# EAGLE design PCB_Instrumentação_v2 (EAGLE 8.2.0)
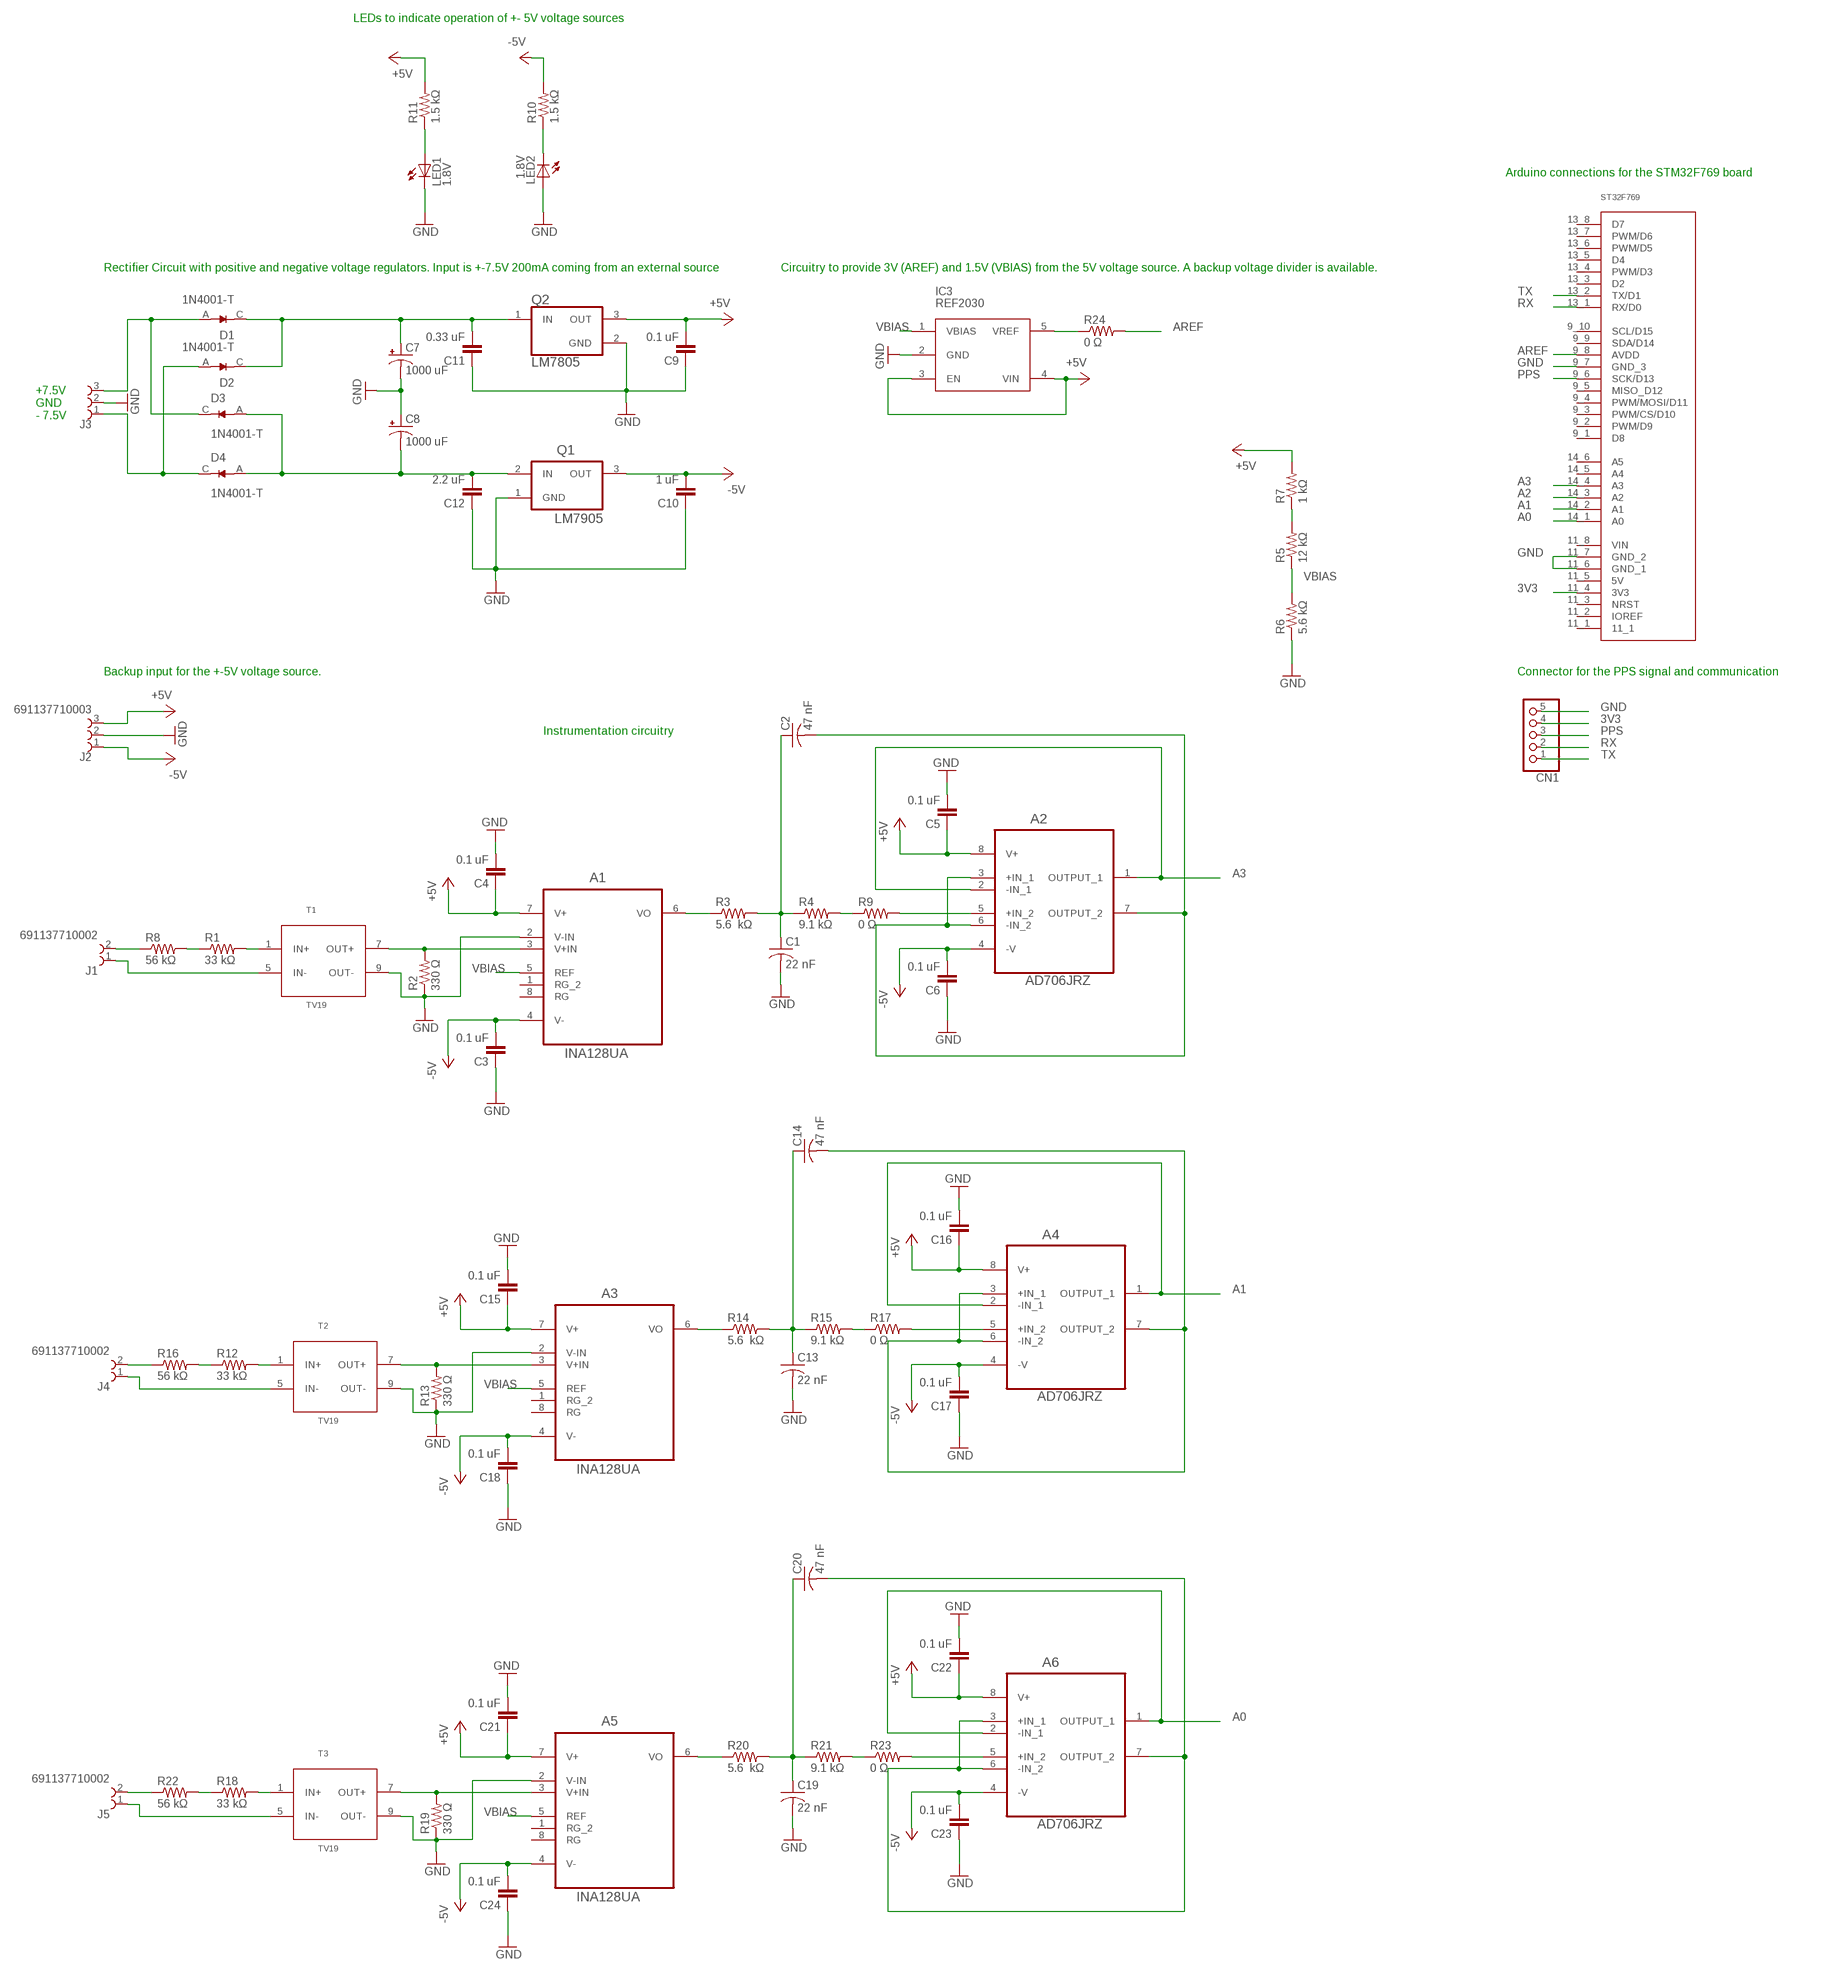
[diagram p0: schematic, sheet 1]

## Parts
A1  INA128UA  [SOIC127P600X175-8N]
A2  AD706JRZ  AD706JRZ-REEL-REEL7  [SOIC127P600X175-8N]
A3  INA128UA  [SOIC127P600X175-8N]
A4  AD706JRZ  AD706JRZ-REEL-REEL7  [SOIC127P600X175-8N]
A5  INA128UA  [SOIC127P600X175-8N]
A6  AD706JRZ  AD706JRZ-REEL-REEL7  [SOIC127P600X175-8N]
C1  22 nF  C-USC1206  [C1206]
C2  47 nF  C-USC1206  [C1206]
C3  0.1 uF  C-EUC0805  [C0805]
C4  0.1 uF  C-EUC0805  [C0805]
C5  0.1 uF  C-EUC0805  [C0805]
C6  0.1 uF  C-EUC0805  [C0805]
C7  1000 uF  CPOL-USE5-10.5  [E5-10,5]
C8  1000 uF  CPOL-USE5-10.5  [E5-10,5]
C9  0.1 uF  C-EUC0805  [C0805]
C10  1 uF  C-EUC0805  [C0805]
C11  0.33 uF  C-EUC0805  [C0805]
C12  2.2 uF  C-EUC0805  [C0805]
C13  22 nF  C-USC1206  [C1206]
C14  47 nF  C-USC1206  [C1206]
C15  0.1 uF  C-EUC0805  [C0805]
C16  0.1 uF  C-EUC0805  [C0805]
C17  0.1 uF  C-EUC0805  [C0805]
C18  0.1 uF  C-EUC0805  [C0805]
C19  22 nF  C-USC1206  [C1206]
C20  47 nF  C-USC1206  [C1206]
C21  0.1 uF  C-EUC0805  [C0805]
C22  0.1 uF  C-EUC0805  [C0805]
C23  0.1 uF  C-EUC0805  [C0805]
C24  0.1 uF  C-EUC0805  [C0805]
CN1  PINHD-1X5  [1X05]
D1  1N4001-T  [DIOAD953W69L521D272]
D2  1N4001-T  [DIOAD953W69L521D272]
D3  1N4001-T  [DIOAD953W69L521D272]
D4  1N4001-T  [DIOAD953W69L521D272]
IC3  REF2030  [TSOT-23_S5]
J1  691137710002  [691137710002]
J2  691137710003  [691137710003]
J3  691137710003  [691137710003]
J4  691137710002  [691137710002]
J5  691137710002  [691137710002]
LED1  1.8V  LED5MM  [LED5MM]
LED2  1.8V  LED5MM  [LED5MM]
Q1  LM7905  L7905ACV  [TO254P450X1020X1935-3P]
Q2  LM7805  LM7805CT/NOPB  [TO254P1054X470X2600-3]
R1  33 kΩ  R-US_0207/7  [0207/7]
R2  330 Ω  R-US_0207/7  [0207/7]
R3  5.6 kΩ  R-US_R1206  [R1206]
R4  9.1 kΩ  R-US_R1206  [R1206]
R5  12 kΩ  R-US_R1206  [R1206]
R6  5.6 kΩ  R-US_R1206  [R1206]
R7  1 kΩ  R-US_R1206  [R1206]
R8  56 kΩ  R-US_0207/7  [0207/7]
R9  0 Ω  R-US_R1206  [R1206]
R10  1.5 kΩ  R-US_R1206  [R1206]
R11  1.5 kΩ  R-US_R1206  [R1206]
R12  33 kΩ  R-US_0207/7  [0207/7]
R13  330 Ω  R-US_0207/7  [0207/7]
R14  5.6 kΩ  R-US_R1206  [R1206]
R15  9.1 kΩ  R-US_R1206  [R1206]
R16  56 kΩ  R-US_0207/7  [0207/7]
R17  0 Ω  R-US_R1206  [R1206]
R18  33 kΩ  R-US_0207/7  [0207/7]
R19  330 Ω  R-US_0207/7  [0207/7]
R20  5.6 kΩ  R-US_R1206  [R1206]
R21  9.1 kΩ  R-US_R1206  [R1206]
R22  56 kΩ  R-US_0207/7  [0207/7]
R23  0 Ω  R-US_R1206  [R1206]
R24  0 Ω  R-US_R1206  [R1206]
T1  TV19  [TV19]
T2  TV19  [TV19]
T3  TV19  [TV19]
U$1  ST32F769  [ST32F769]

## Nets
3V3: CN1.4 U$1.11_4(3V3)
+5V: A1.7(V+) A2.8(V+) A3.7(V+) A4.8(V+) A5.7(V+) A6.8(V+) C4.1 C5.1 C9.2 C15.1 C16.1 C21.1 C22.1 IC3.3(EN) IC3.4(VIN) J2.3 Q2.3(OUT) R7.2 R11.2
-5V: A1.4(V-) A2.4(-V) A3.4(V-) A4.4(-V) A5.4(V-) A6.4(-V) C3.2 C6.2 C10.2 C17.2 C18.2 C23.2 C24.2 J2.1 Q1.3(OUT) R10.2
A0: A6.1(OUTPUT_1) A6.2(-IN_1) U$1.14_1(A0)
A1: A4.1(OUTPUT_1) A4.2(-IN_1) U$1.14_2(A1)
A2: U$1.14_3(A2)
A3: A2.1(OUTPUT_1) A2.2(-IN_1) U$1.14_4(A3)
AREF: R24.2 U$1.9_8(AVDD)
GND: A1.2(V-IN) A3.2(V-IN) A5.2(V-IN) C1.2 C3.1 C4.2 C5.2 C6.1 C7.- C8.+ C9.1 C10.1 C11.1 C12.1 C13.2 C15.2 C16.2 C17.1 C18.1 C19.2 C21.2 C22.2 C23.1 C24.1 CN1.5 IC3.2(GND) J2.2 J3.2 LED1.K(C) LED2.A Q1.1(GND) Q2.2(GND) R2.1 R6.1 R13.1 R19.1 T1.9(OUT-) T2.9(OUT-) T3.9(OUT-) U$1.9_7(GND_3) U$1.11_6(GND_1) U$1.11_7(GND_2)
N$1: R1.2 T1.1(IN+)
N$2: A1.3(V+IN) R2.2 T1.7(OUT+)
N$3: A1.6(VO) R3.1
N$4: C1.1 C2.1 R3.2 R4.1
N$5: R4.2 R9.1
N$6: A2.3(+IN_1) A2.6(-IN_2) A2.7(OUTPUT_2) C2.2
N$7: R5.2 R7.1
N$8: J1.2 R8.1
N$9: J1.1 T1.5(IN-)
N$10: R1.1 R8.2
N$11: C7.+ C11.2 D1.C D2.C Q2.1(IN)
N$12: C8.- C12.2 D3.A D4.A Q1.2(IN)
N$13: D2.A D4.C J3.1
N$14: D1.A D3.C J3.3
N$15: A2.5(+IN_2) R9.2
N$16: LED1.A R11.1
N$17: LED2.K(C) R10.1
N$18: R12.2 T2.1(IN+)
N$19: A3.3(V+IN) R13.2 T2.7(OUT+)
N$20: A3.6(VO) R14.1
N$21: C13.1 C14.1 R14.2 R15.1
N$22: A4.3(+IN_1) A4.6(-IN_2) A4.7(OUTPUT_2) C14.2
N$23: J4.1 T2.5(IN-)
N$24: J4.2 R16.1
N$25: R12.1 R16.2
N$26: R15.2 R17.1
N$27: A4.5(+IN_2) R17.2
N$28: R18.2 T3.1(IN+)
N$29: A5.3(V+IN) R19.2 T3.7(OUT+)
N$30: A5.6(VO) R20.1
N$31: C19.1 C20.1 R20.2 R21.1
N$32: A6.3(+IN_1) A6.6(-IN_2) A6.7(OUTPUT_2) C20.2
N$33: J5.1 T3.5(IN-)
N$34: J5.2 R22.1
N$35: R18.1 R22.2
N$36: R21.2 R23.1
N$37: A6.5(+IN_2) R23.2
N$39: IC3.5(VREF) R24.1
PPS: CN1.3 U$1.9_6(SCK/D13)
RX: CN1.2 U$1.13_1(RX/D0)
TX: CN1.1 U$1.13_2(TX/D1)
VBIAS: A1.5(REF) A3.5(REF) A5.5(REF) IC3.1(VBIAS) R5.1 R6.2
Unconnected: A1.1(RG_2) A1.8(RG) A3.1(RG_2) A3.8(RG) A5.1(RG_2) A5.8(RG) U$1.9_1(D8) U$1.9_2(PWM/D9) U$1.9_3(PWM/CS/D10) U$1.9_4(PWM/MOSI/D11) U$1.9_5(MISO_D12) U$1.9_9(SDA/D14) U$1.9_10(SCL/D15) U$1.11_1 U$1.11_2(IOREF) U$1.11_3(NRST) U$1.11_5(5V) U$1.11_8(VIN) U$1.13_3(D2) U$1.13_4(PWM/D3) U$1.13_5(D4) U$1.13_6(PWM/D5) U$1.13_7(PWM/D6) U$1.13_8(D7) U$1.14_5(A4) U$1.14_6(A5)

## Notes on the sheet
- LEDs to indicate operation of +- 5V voltage sources
- Arduino connections for the STM32F769 board
- Rectifier Circuit with positive and negative voltage regulators. Input is +-7.5V 200mA coming from an external source | Circuitry to provide 3V (AREF) and 1.5V (VBIAS) from the 5V voltage source. A backup voltage divider is available.
- +7.5V
  GND
  - 7.5V
- Backup input for the +-5V voltage source. | Connector for the PPS signal and communication
- Instrumentation circuitry

## Library data of the parts
A1 A3 A5 = INA128UA:INA128UA: INSTRUMENTATION AMPLIFIER; AVAILABILITY: Unavailable; MF: Texas; MP: INA128UA; PACKAGE: SOIC-8 Burr Brown; PRICE: None
A2 A4 A6 = AD706JRZ_v2:AD706JRZ-REEL-REEL7: Picoampere Input Current Dual Bipolar Op Amp; AVAILABILITY: Unavailable; DESCRIPTION: Ic Opamp Gp Dual Prec 15ma 8soic - Ad706jrz-Reel7; MF: Analog Devices; MP: AD706JRZ-REEL7; PACKAGE: SOIC-8 Analog Devices; PRICE: None
C1 C2 C13 C14 C19 C20 = rcl:C-US: CAPACITOR, American symbol
C3-C6 C9-C12 C15-C18 C21-C24 = resistor:C-EU: CAPACITOR, European symbol
C7 C8 = rcl:CPOL-US: POLARIZED CAPACITOR, American symbol
CN1 = my_pinhead:PINHD-1X5: PIN HEADER
D1-D4 = 1N4001-T:1N4001-T: Diode, Standard Recovery, 1a, 50v, Do-204al-2, Full Reel; AVAILABILITY: Unavailable; DESCRIPTION: Diode, Standard, 1A, 50V; MF: ON Semiconductor; MP: 1N4001; PACKAGE: DO-41 ON Semiconductor; PRICE: None
IC3 = TSOT-23_S5:REF2030: REF2030 Low-Drift, Low-Power, Dual-Output, VREF and VREF / 2 Voltage References
J1 J4 J5 = Term Block 2pos Side Entry 5mm:691137710002: SERIE 1377 - 5.00 MM - HORIZONTAL CABLE ENTRY WITH PRESSURE CLAMP - GLOW WIRE PLASTIC - WR-TBL <http://katalog.we-online.de/media/images/v2/Family_WR-TBL1_6911377100xx.jpg> Details see: http://katalog.we-online.de/en/em/TBL_5_00_1377_HORIZONTAL_ENTRY_W_PRESSURE_CLAMP_GLOW_WIRE_6911377100xx Created by Yingchun,Shan 2016(C) Wurth Elektronik; AVAILABILITY: Unavailable; DESCRIPTION: Term Block 2pos Side Entry 5mm; MF: Wurth Electronics; MP: 691137710002; PACKAGE: None; PRICE: None
J2 J3 = Term Block 3pos 5mm:691137710003: SERIE 1377 - 5.00 MM - HORIZONTAL CABLE ENTRY WITH PRESSURE CLAMP - GLOW WIRE PLASTIC - WR-TBL <http://katalog.we-online.de/media/images/v2/Family_WR-TBL1_6911377100xx.jpg> Details see: http://katalog.we-online.de/en/em/TBL_5_00_1377_HORIZONTAL_ENTRY_W_PRESSURE_CLAMP_GLOW_WIRE_6911377100xx Created by Yingchun,Shan 2016(C) Wurth Elektronik; AVAILABILITY: Unavailable; DESCRIPTION: Term Block 3POS Side Entry 5MM; MF: Wurth Electronics; MP: 691137710003; PACKAGE: None; PRICE: None
LED1 = my_led:LED: LED OSRAM: - CHIPLED LG R971, LG N971, LY N971, LG Q971, LY Q971, LO R971, LY R971 LH N974, LH R974 LS Q976, LO Q976, LY Q976 LO Q996 - Hyper CHIPLED LW Q18S LB Q993, LB Q99A, LB R99A - SideLED LS A670, LO A670, LY A670, LG A670, LP A670 LB A673, LV A673, LT A673, LW A673 LH A674 LY A675 LS A676, LA A676, LO A676, LY A676, LW A676 LS A679, LY A679, LG A679 - Hyper Micro SIDELED® LS Y876, LA Y876, LO Y876, LY Y876 LT Y87S - SmartLED LW L88C, LW L88S LB L89C, LB L89S, LG L890 LS L89K, LO L89K, LY L89K LS L896, LA L896, LO L896, LY L896 - TOPLED LS T670, LO T670, LY T670, LG T670, LP T670 LSG T670, LSP T670, LSY T670, LOP T670, LYG T670 LG T671, LOG T671, LSG T671 LB T673, LV T673, LT T673, LW T673 LH T674 LS T676, LA T676, LO T676, LY T676, LB T676, LH T676, LSB T676, LW T676 LB T67C, LV T67C, LT T67C, LS T67K, LO T67K, LY T67K, LW E67C LS E67B, LA E67B, LO E67B, LY E67B, LB E67C, LV E67C, LT E67C LW T67C LS T679, LY T679, LG T679 LS T770, LO T770, LY T770, LG T770, LP T770 LB T773, LV T773, LT T773, LW T773 LH T774 LS E675, LA E675, LY E675, LS T675 LS T776, LA T776, LO T776, LY T776, LB T776 LHGB T686 LT T68C, LB T68C - Hyper Mini TOPLED® LB M676 - Mini TOPLED Santana® LG M470 LS M47K, LO M47K, LY M47K Source: http://www.osram.convergy.de LUXEON: - LUMILED® LXK2-PW12-R00, LXK2-PW12-S00, LXK2-PW14-U00, LXK2-PW14-V00 LXK2-PM12-R00, LXK2-PM12-S00, LXK2-PM14-U00 LXK2-PE12-Q00, LXK2-PE12-R00, LXK2-PE12-S00, LXK2-PE14-T00, LXK2-PE14-U00 LXK2-PB12-K00, LXK2-PB12-L00, LXK2-PB12-M00, LXK2-PB14-N00, LXK2-PB14-P00, LXK2-PB14-Q00 LXK2-PR12-L00, LXK2-PR12-M00, LXK2-PR14-Q00, LXK2-PR14-R00 LXK2-PD12-Q00, LXK2-PD12-R00, LXK2-PD12-S00 LXK2-PH12-R00, LXK2-PH12-S00 LXK2-PL12-P00, LXK2-PL12-Q00, LXK2-PL12-R00 Source: www.luxeon.com KINGBRIGHT: KA-3528ASYC Source: www.kingbright.com
LED2 = led:LED: LED OSRAM: - CHIPLED LG R971, LG N971, LY N971, LG Q971, LY Q971, LO R971, LY R971 LH N974, LH R974 LS Q976, LO Q976, LY Q976 LO Q996 - Hyper CHIPLED LW Q18S LB Q993, LB Q99A, LB R99A - SideLED LS A670, LO A670, LY A670, LG A670, LP A670 LB A673, LV A673, LT A673, LW A673 LH A674 LY A675 LS A676, LA A676, LO A676, LY A676, LW A676 LS A679, LY A679, LG A679 - Hyper Micro SIDELED® LS Y876, LA Y876, LO Y876, LY Y876 LT Y87S - SmartLED LW L88C, LW L88S LB L89C, LB L89S, LG L890 LS L89K, LO L89K, LY L89K LS L896, LA L896, LO L896, LY L896 - TOPLED LS T670, LO T670, LY T670, LG T670, LP T670 LSG T670, LSP T670, LSY T670, LOP T670, LYG T670 LG T671, LOG T671, LSG T671 LB T673, LV T673, LT T673, LW T673 LH T674 LS T676, LA T676, LO T676, LY T676, LB T676, LH T676, LSB T676, LW T676 LB T67C, LV T67C, LT T67C, LS T67K, LO T67K, LY T67K, LW E67C LS E67B, LA E67B, LO E67B, LY E67B, LB E67C, LV E67C, LT E67C LW T67C LS T679, LY T679, LG T679 LS T770, LO T770, LY T770, LG T770, LP T770 LB T773, LV T773, LT T773, LW T773 LH T774 LS E675, LA E675, LY E675, LS T675 LS T776, LA T776, LO T776, LY T776, LB T776 LHGB T686 LT T68C, LB T68C - Hyper Mini TOPLED® LB M676 - Mini TOPLED Santana® LG M470 LS M47K, LO M47K, LY M47K Source: http://www.osram.convergy.de LUXEON: - LUMILED® LXK2-PW12-R00, LXK2-PW12-S00, LXK2-PW14-U00, LXK2-PW14-V00 LXK2-PM12-R00, LXK2-PM12-S00, LXK2-PM14-U00 LXK2-PE12-Q00, LXK2-PE12-R00, LXK2-PE12-S00, LXK2-PE14-T00, LXK2-PE14-U00 LXK2-PB12-K00, LXK2-PB12-L00, LXK2-PB12-M00, LXK2-PB14-N00, LXK2-PB14-P00, LXK2-PB14-Q00 LXK2-PR12-L00, LXK2-PR12-M00, LXK2-PR14-Q00, LXK2-PR14-R00 LXK2-PD12-Q00, LXK2-PD12-R00, LXK2-PD12-S00 LXK2-PH12-R00, LXK2-PH12-S00 LXK2-PL12-P00, LXK2-PL12-Q00, LXK2-PL12-R00 Source: www.luxeon.com KINGBRIGHT: KA-3528ASYC Source: www.kingbright.com
Q1 = L7905ACV:L7905ACV: 2 % negative voltage regulators; AVAILABILITY: Unavailable; DESCRIPTION: L7905 Series -5 V 1.5 A Negative Voltage Regulator Flange Mount - TO-220; MF: STMicroelectronics; MP: L7905ACV; PACKAGE: TO-220 STMicroelectronics; PRICE: None
Q2 = LM7805CT_NOPB:LM7805CT/NOPB: Standard Regulator Pos 5V 1A 3-Pin(3+Tab) TO-220 Rail; AVAILABILITY: Unavailable; MF: ON Semiconductor; MP: LM7805CT; PACKAGE: TO-220 ON Semiconductor; PRICE: None
R1 R2 R8 R12 R13 R16 R18 R19 R22 = my_resistor:R-US_: RESISTOR, American symbol
R3-R7 R9-R11 R14 R15 R17 R20 R21 R23 R24 = resistor:R-US_: RESISTOR, American symbol
T1-T3 = TV19:TV19: Model: TV19 Characteristics: TV19 is a current type voltage transformer, using ultracrystalline core. Primarey current will be different according to different voltage working on the current-limiting resistance. And there will be a same current at secondary as primary. Technical index: Mounting type: PCB mounting Material of the core: Nanocrystalline Flame resistance: UL94-V0 Operating temperature: -35ºC~+85ºC Storage temperature: -45ºC~+95ºC Frequency range: 20Hz - 20KHz Dielectric strength: 3.5KV 50Hz 1min Electrical parameters : Primary Max. working current: 5mA Secondary output current: 5mA Turns ratio: 1000:1000 Accuracy: +-1% Linearity: 0.2% Max. measuring voltage: 500V Phase difference: <=25º Max. sampling resistance: 500 ohms Weight: 15g
U$1 = ST32F769:ST32F769: 32F769IDISCOVERY board

## Board
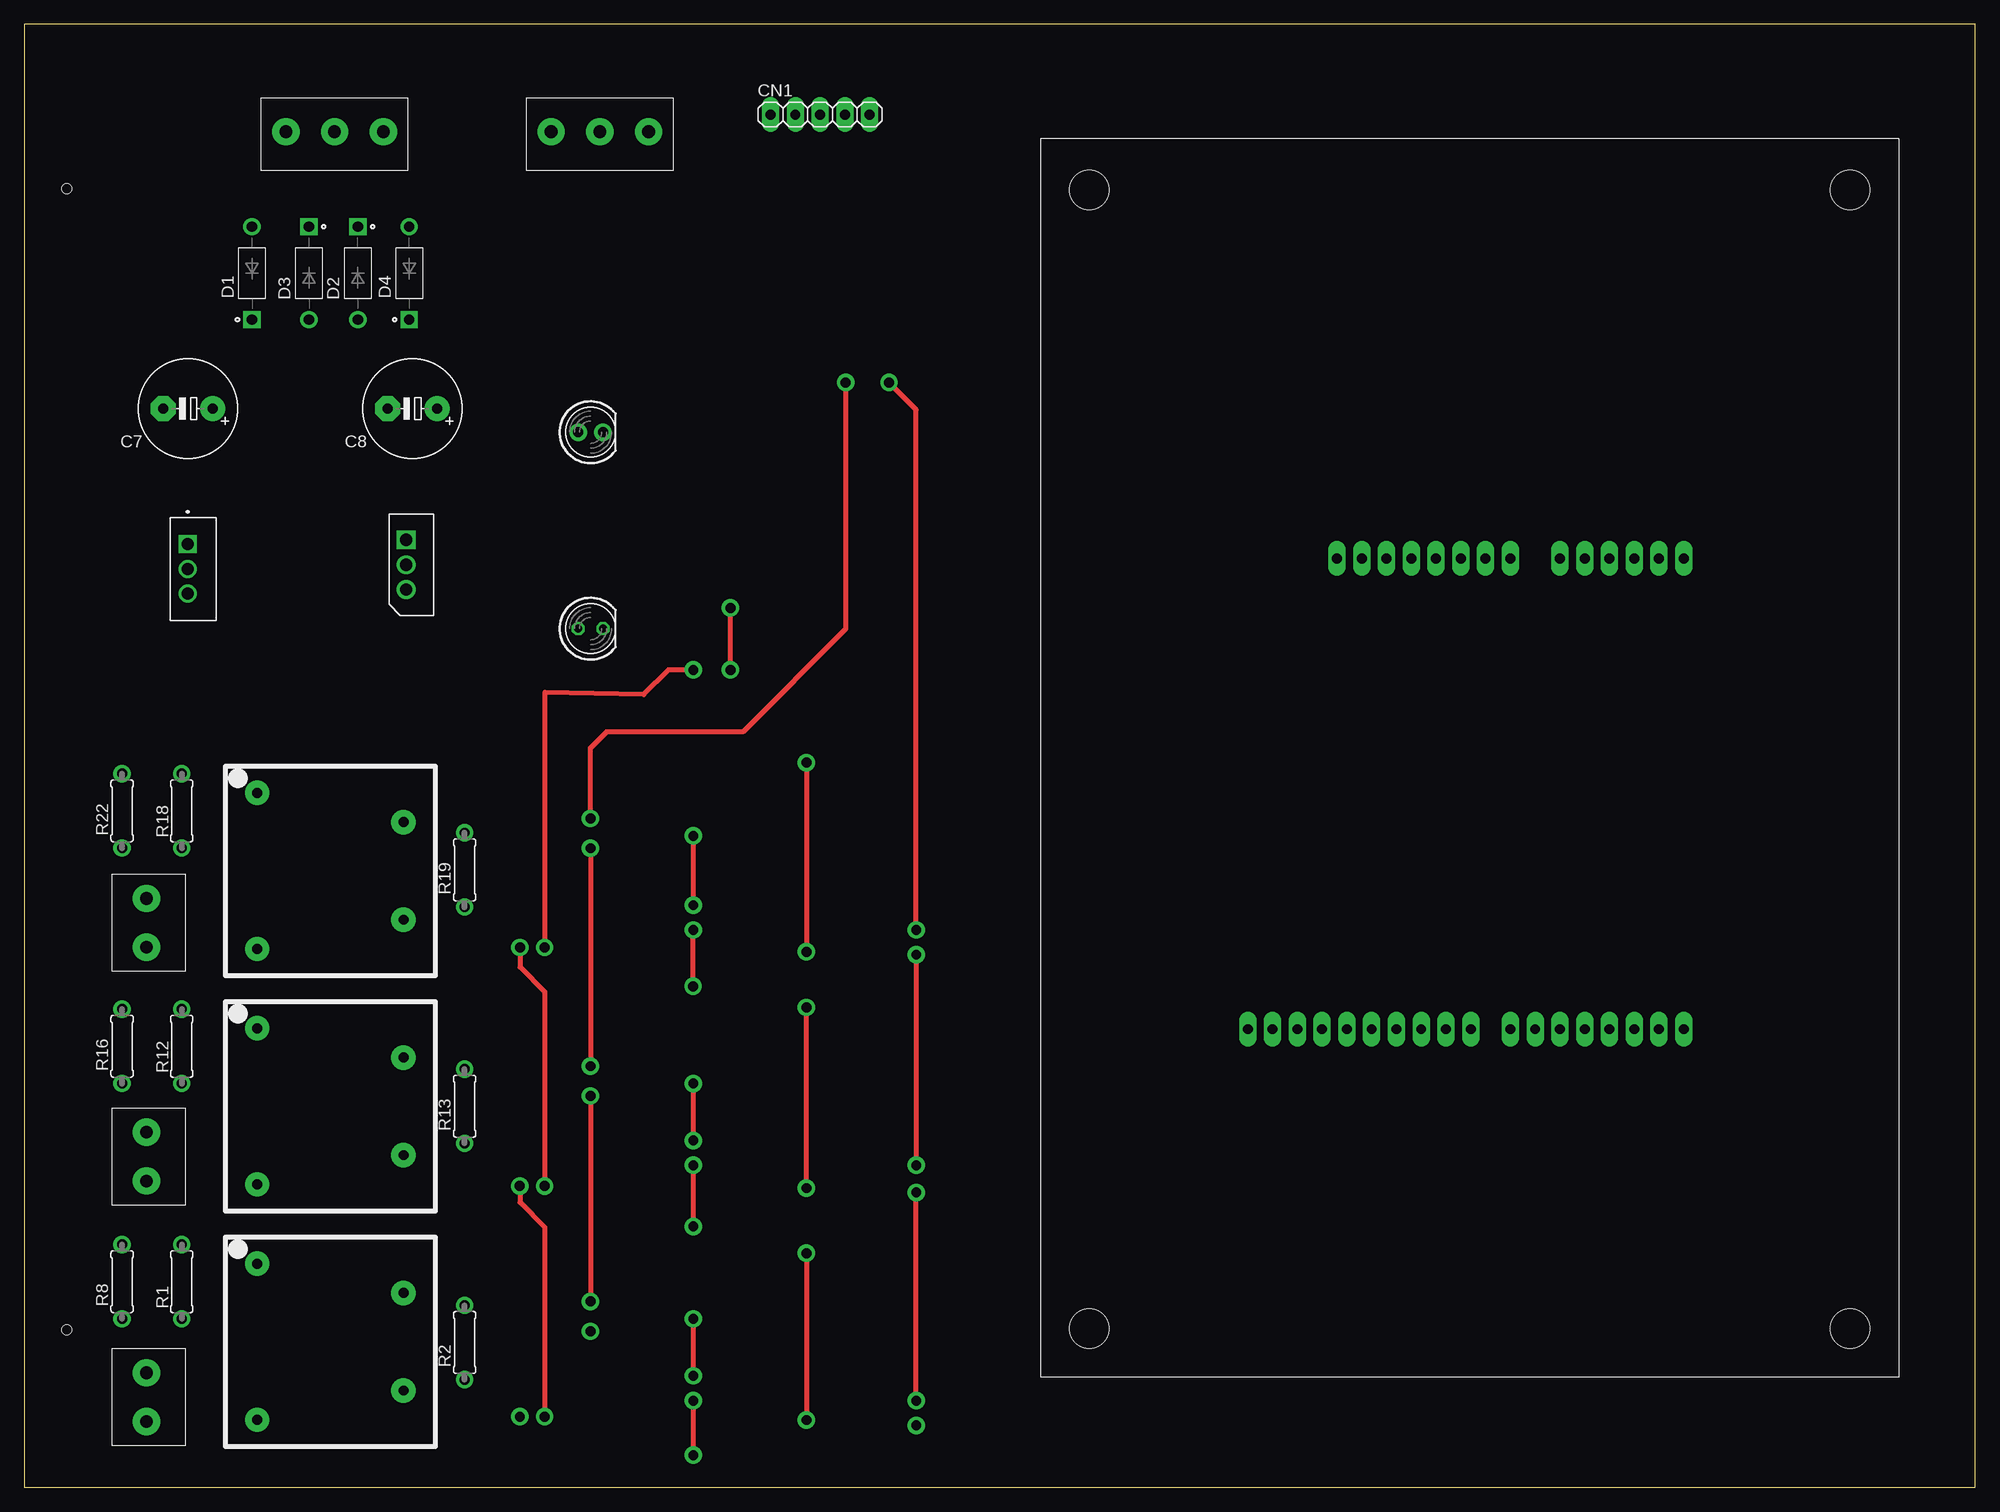
[diagram p1: board, top side]
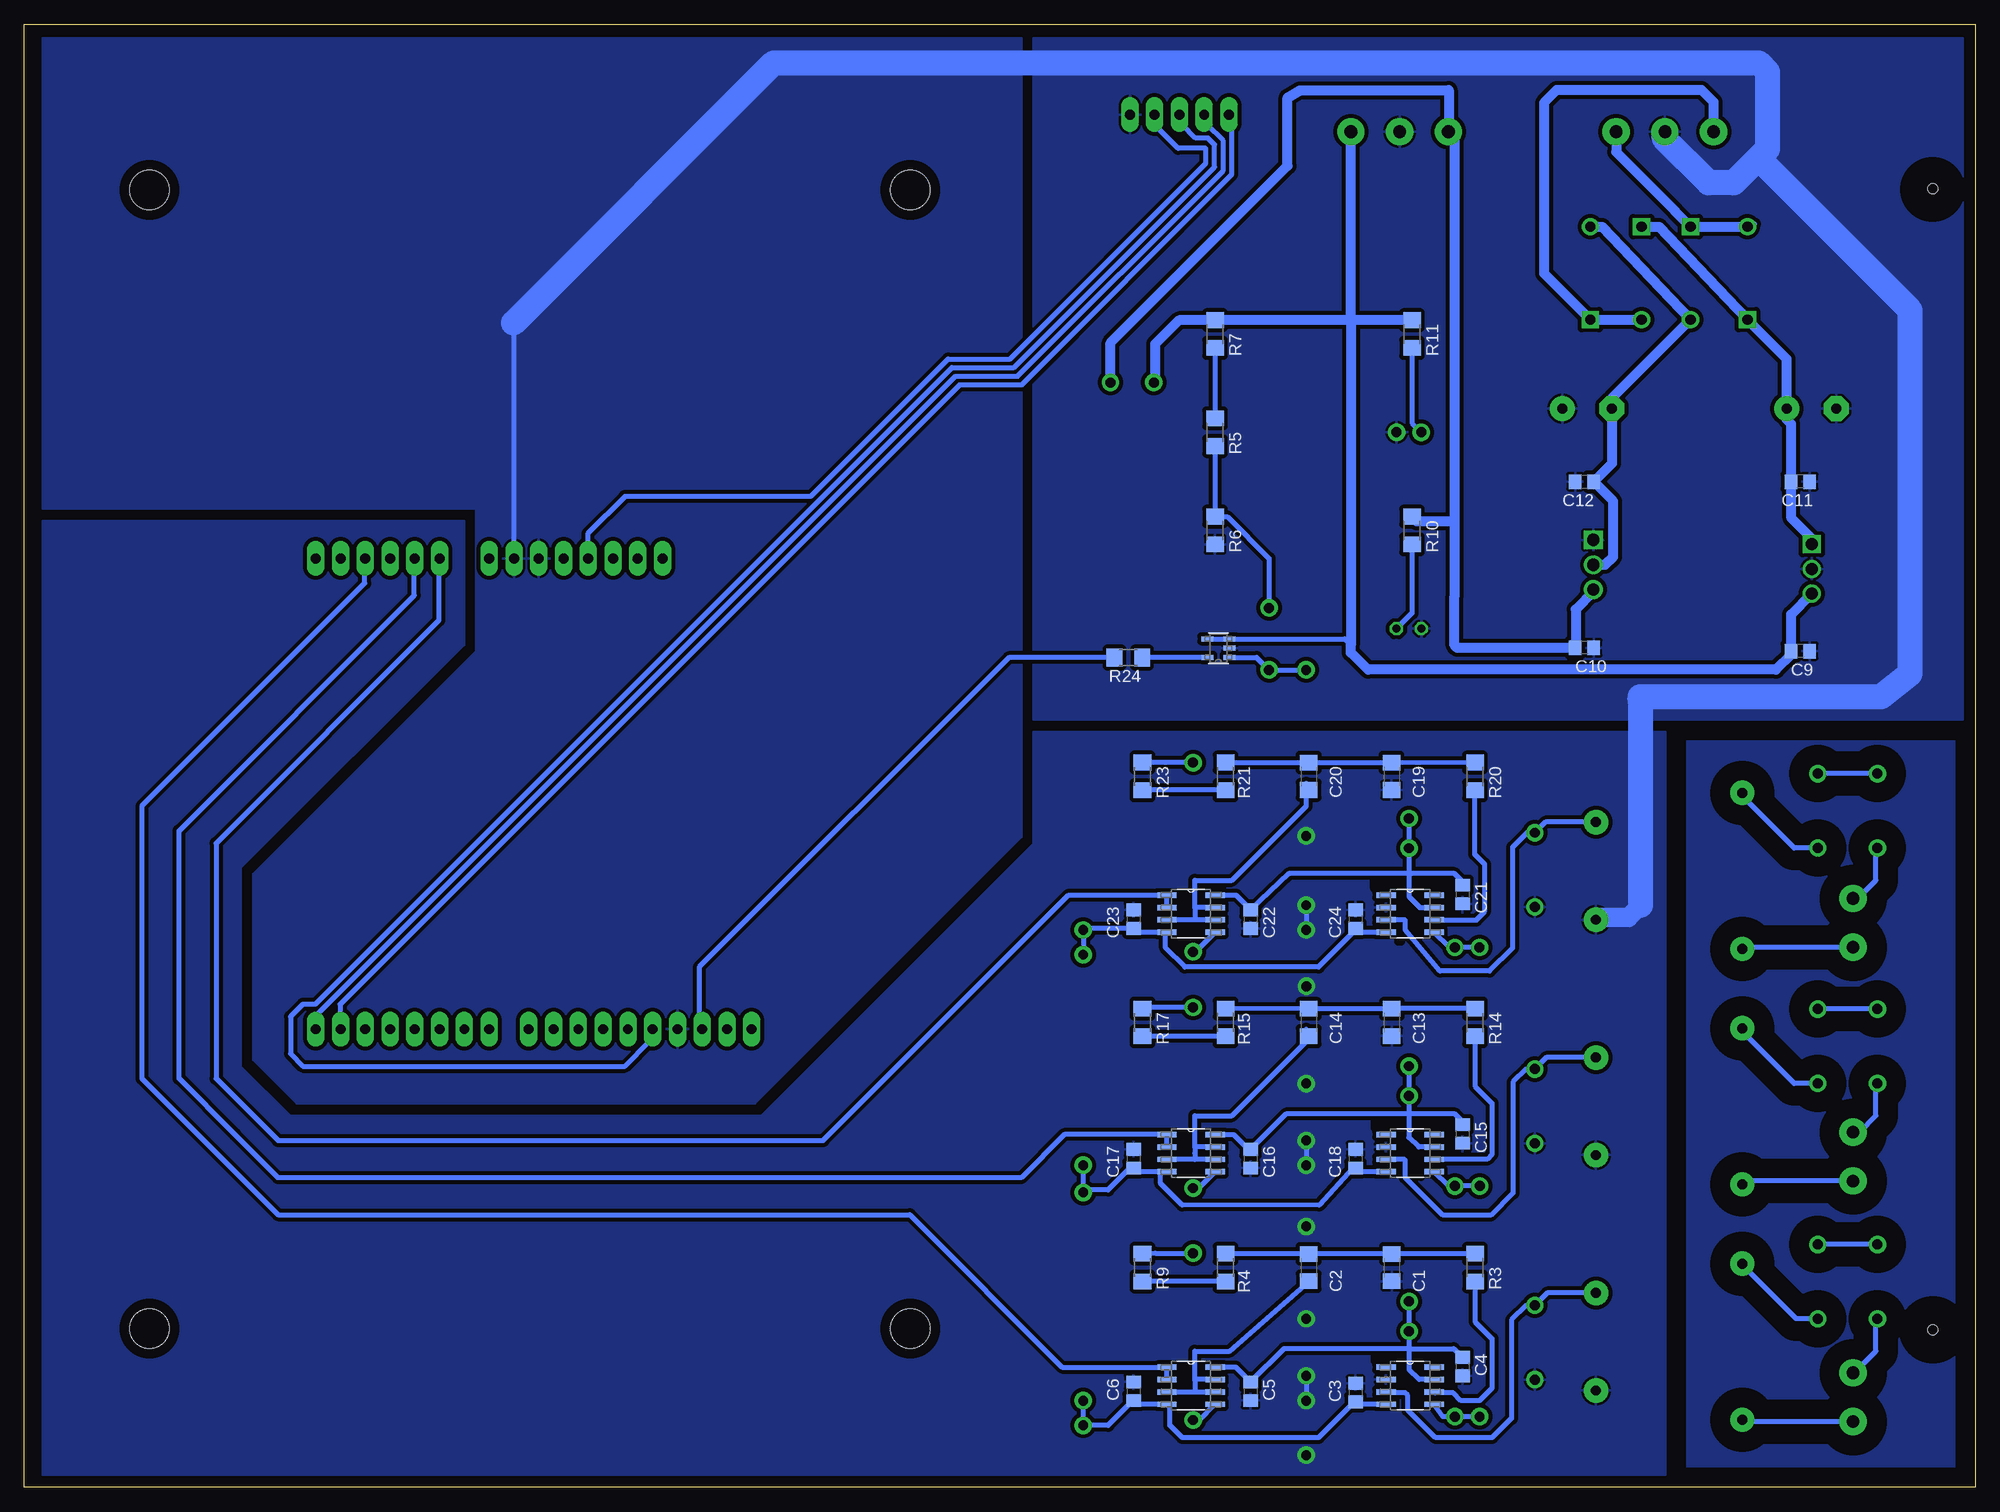
[diagram p2: board, bottom side, seen from below]

Size 200 x 150 mm. Coordinates in mm from the lower left corner, seen from the top.
Outline: 0,0 200,0 200,150 0,150 0,0
Copper layers (1*16): Top 0.035mm / dielectric 1.5mm / Bottom 0.035mm
Design rules "default *": minimum track width 6mil, minimum drill 0.35mm, track to track 15mil, track to pad 15mil, pad to pad 15mil, via to via 15mil, smd to smd 15mil, copper to edge 40mil, drill to drill 15mil, minimum pad ring 10mil, minimum via ring 8mil, stop-mask expansion 4mil, vias tented up to drill 0mil, thermal gap 10mil
Holes 1 mm at 4.34,16.15 4.34,133.16
bRestrict: area 54.6,12.9 to 57.6,13.7; area 59.1,12.9 to 61.5,13.7; area 53.5,36.8 to 56.3,37.7; area 53.3,34.2 to 54.3,36.9; area 59.1,36.8 to 61.5,37.8; area 53.6,61.4 to 56.4,62.4; area 53.4,58.6 to 54.3,62.4; area 59.6,61.4 to 61.6,62.4; area 84,9 to 85.3,11.8; area 2.7,131.4 to 6,134.7; area 4.2,16 to 4.5,16.3; area 53.5,10.3 to 54.3,13.6; 14 more areas

### Footprints (pad centres in the part's own frame; a part is rotated, then mirrored left to right if it is on the bottom)
SOIC127P600X175-8N = smd 1.981 x 0.559: 1 -2.464,1.905; 2 -2.464,0.635; 3 -2.464,-0.635; 4 -2.464,-1.905; 5 2.464,-1.905; 6 2.464,-0.635; 7 2.464,0.635; 8 2.464,1.905
C1206 = smd 1.6 x 1.8: 1 -1.4,0; 2 1.4,0
C0805 = smd 1.3 x 1.5: 1 -0.95,0; 2 0.95,0
E5-10,5 = drill 1.016 pad 2.54: + -2.54,0 | drill 1.016 pad 2.54 octagon: - 2.54,0
1X05 = drill 1.016 pad 1.778 long: 1 -5.08,0; 2 -2.54,0; 3 0,0; 4 2.54,0; 5 5.08,0
DIOAD953W69L521D272 = drill 1.06 pad 1.778: A 4.765,0 | drill 1.06 pad 1.778 square: C -4.765,0
TSOT-23_S5 = smd 1.219 x 0.508: 1 -1.143,0.95; 2 -1.143,0; 3 -1.143,-0.95; 4 1.143,-0.95; 5 1.143,0.95
691137710002 = drill 1.3 pad 2.794: 1 -2.5,0; 2 2.5,0
691137710003 = drill 1.3 pad 2.794: 1 -5,0; 2 0,0; 3 5,0
LED5MM = drill 1.016 pad 1.778: A -1.27,0; K 1.27,0
LED5MM' = drill 0.813 octagon: A -1.27,0; K 1.27,0
TO254P450X1020X1935-3P = drill 1.27 square: 1 -5.08,-1.092 | drill 1.27: 2 -2.54,-1.092; 3 0,-1.092
TO254P1054X470X2600-3 = drill 1.24 square: 1 0,0 | drill 1.24: 2 2.54,0; 3 5.08,0
0207/7 = drill 1.016 pad 1.778: 1 -3.81,0; 2 3.81,0
R1206 = smd 1.6 x 1.803: 1 -1.422,0; 2 1.422,0
TV19 = drill 1.016 pad 2.5: 1 -8,-7.5; 5 8,-7.5; 7 -5,7.5; 9 5,7.5
ST32F769 = drill 1.016 pad 1.778 long: 9_1 43.884,91.29; 9_2 46.424,91.29; 9_3 48.964,91.29; 9_4 51.504,91.29; 9_5 54.044,91.29; 9_6 56.584,91.29; 9_7 59.124,91.29; 9_8 61.664,91.29; 9_9 64.204,91.29; 9_10 66.744,91.29; 11_1 57.6,43.03; 11_2 55.06,43.03; 11_3 52.52,43.03; 11_4 49.98,43.03; 11_5 47.44,43.03; 11_6 44.9,43.03; 11_7 42.36,43.03; 11_8 39.82,43.03; 13_1 22.04,91.29; 13_2 24.58,91.29; 13_3 27.12,91.29; 13_4 29.66,91.29; 13_5 32.2,91.29; 13_6 34.74,91.29; 13_7 37.28,91.29; 13_8 39.82,91.29; 14_1 34.74,43.03; 14_2 32.2,43.03; 14_3 29.66,43.03; 14_4 27.12,43.03; 14_5 24.58,43.03; 14_6 22.04,43.03 | hole 4.064: 5,5.26; 83,5.26; 83,122; 5,122

### Placement (x,y rotation side)
A1  57.93,10.42 0 bottom
A2  80.39,10.42 0 bottom
A3  57.93,34.26 0 bottom
A4  80.39,34.26 0 bottom
A5  57.93,58.82 0 bottom
A6  80.39,58.82 0 bottom
C1  59.8,22.53 270 bottom
C2  68.33,22.53 270 bottom
C3  63.52,9.72 270 bottom
C4  52.55,12.39 270 bottom
C5  74.28,9.85 270 bottom
C6  86.28,9.85 270 bottom
C7  16.77,110.6 180 top
C8  39.77,110.6 180 top
C9  17.92,85.73 180 bottom
C10  40.06,86.08 180 bottom
C11  17.92,103.11 180 bottom
C12  40.06,103.11 0 bottom
C13  59.8,47.66 270 bottom
C14  68.33,47.66 270 bottom
C15  52.55,36.23 270 bottom
C16  74.28,33.69 270 bottom
C17  86.28,33.69 270 bottom
C18  63.52,33.69 270 bottom
C19  59.83,72.9 270 bottom
C20  68.33,72.9 270 bottom
C21  52.55,60.79 270 bottom
C22  74.28,58.25 270 bottom
C23  86.28,58.25 270 bottom
C24  63.52,58.25 270 bottom
CN1  81.58,140.76 0 top
D1  23.35,124.49 90 top
D2  34.19,124.49 270 top
D3  29.19,124.49 270 top
D4  39.46,124.49 90 top
IC3  77.58,86.04 180 bottom
J1  12.51,9.24 90 top
J2  59,139 0 top
J3  691137710003  [691137710003]  31.8,139 0 top
J4  12.51,33.91 90 top
J5  12.51,57.87 90 top
LED1  58.05,108.18 0 top
LED2  1.8V  [LED5MM']  58.05,88.04 0 top
Q1  40.23,92.05 270 top
Q2  16.74,96.71 270 top
R1  16.13,21.09 270 top
R2  45.14,14.85 90 top
R3  51.28,22.53 90 bottom
R4  76.85,22.53 270 bottom
R5  77.93,108.18 90 bottom
R6  77.93,98.11 90 bottom
R7  77.93,118.25 90 bottom
R8  10.02,21.09 90 top
R9  85.37,22.53 90 bottom
R10  57.73,98.11 90 bottom
R11  57.73,118.25 90 bottom
R12  16.13,45.22 270 top
R13  45.14,39.08 90 top
R14  51.28,47.66 90 bottom
R15  76.85,47.66 270 bottom
R16  10.02,45.22 90 top
R17  85.37,47.66 90 bottom
R18  16.13,69.36 270 top
R19  45.14,63.31 90 top
R20  51.28,72.9 90 bottom
R21  76.85,72.9 270 bottom
R22  10.02,69.36 90 top
R23  85.37,72.9 90 bottom
R24  86.82,85.08 180 bottom
T1  31.37,14.93 270 top
T2  31.37,39.06 270 top
T3  31.37,63.2 270 top
U$1  192.17,138.27 180 top

### Tracks (layer width: path | path; a pad name or v marks a point on that pad's centre or on a via)
3V3
  Bottom 0.508: U$1.11_4 142.24,95.29 142.24,97.79 138.43,101.6 119.38,101.6 105.28,115.7 98.93,115.7 78.87,135.76 78.87,137.3 81.72,137.3 84.12,139.7 CN1.4
+5V  (via drill 1.02 pad 1.78)
  Top 0.5: 58.04,75.82 59.69,77.47 73.66,77.47 84.2,88.01 v84.2,113.28
  Top 0.508: v58.04,68.58 58.04,75.82 | v58.04,65.53 v58.04,43.18 | v58.04,40.13 v58.04,19.05
  Bottom 0.5: 18.88,85.75 C9.2 | 63.71,119.67 64,119.38 64.29,119.67 | IC3.4 IC3.3 64.63,86.99 64,86.36 | C4.1 53.44,14.22 58.04,14.22 | 75.8,12.32 C5.1 70.86,14.22 58.04,14.22 | A1.7 57.03,11.05 58.04,12.06 58.04,14.22 | 84.07,113.41 v84.2,113.28 | v58.04,16 58.04,14.22 | 58.04,38.24 58.04,35.88 | v58.04,40.13 58.04,38.24 | 58.04,35.88 58.05,35.87 | A3.7 57.05,34.9 58.04,35.88 | C15.1 52.55,37.5 53.33,38.28 58,38.28 | 58,38.28 58.04,38.24 | 58,38.28 70.65,38.28 C16.1 74.48,34.64 76,36.16 A4.8 | A5.7 56.93,59.45 58.04,60.56 58.05,62.93 | v58.04,65.53 58.05,62.93 | C21.1 52.55,62.1 53.37,62.92 57.81,62.92 58.05,62.93 | 58.05,62.93 70.34,62.93 C22.1 74.28,59.24 75.74,60.7 77.9,60.7 A6.8
  Bottom 0.508: v58.04,68.58 v58.04,65.53 | v58.04,43.18 v58.04,40.13 | v58.04,19.05 v58.04,16 | 75.8,12.32 A2.8
  Bottom 1.016: J2.3 64,119.38 64,86.36 64,85.59 62.24,83.83 20.43,83.83 18.87,85.39 C9.2 | R11.2 63.71,119.67 | 64.29,119.67 R7.2 81.62,119.67 84.07,117.22 84.07,113.41 | C9.2 18.87,85.56 | C9.2 18.87,89.5 Q2.3
-5V  (via drill 1.02 pad 1.78)
  Top 0.5: v91.44,57.15 91.44,110.49 v88.65,113.28
  Top 0.508: v91.44,8.89 v91.44,30.23 | v91.44,54.61 v91.44,33.02
  Bottom 0.5: 41.01,86.62 C10.2 | 57.26,99.06 R10.2 | 53.34,138.39 J2.1 53.98,139.03 | C6.2 | C17.2 86.3,32.77 | 63.78,32.74 C18.2 | 63.78,32.74 67.25,28.94 | A3.4 63.39,32.35 63.78,32.74 | C23.2 91.29,57.3 v91.44,57.15 | 63.52,57.13 C24.2 | 63.52,57.13 67.31,53.34 | A5.4 63.3,56.91 63.52,57.13
  Bottom 0.508: 67.31,53.34 81.04,53.34 83,55.3 83,56.77 A6.4 85.89,56.91 C23.2 | 67.25,28.94 81.31,28.92 81.31,28.94 83.52,31.15 83.52,32.31 82.89,32.31 A4.4 85.89,32.35 C17.2 86.64,32.74 88.9,30.48 91.19,30.48 v91.44,30.23 v91.44,33.02 | v91.44,57.15 v91.44,54.61 | v91.44,8.89 v91.44,6.35 88.9,6.35 86.35,8.9 | 86.35,8.9 C6.2 | 86.35,8.9 85.96,8.51 A2.4 82.55,8.21 82.55,6.35 81.28,5.08 67.31,5.08 63.62,8.77 C3.2 63.26,8.51 A1.4
  Bottom 1.016: 57.26,99.06 53.34,99.06 | 53.34,99.06 53.34,138.39 | 53.34,99.06 53.34,91.44 53.37,91.41 53.37,86.33 53.12,86.08 C10.2 | v88.65,113.28 88.65,117.35 70.48,135.51 70.48,142.49 69.25,143.25 55.27,143.25 53.98,143.26 53.98,139.03 | Q1.3 39.14,91.83 40.95,90.01 40.95,86.67 41.01,86.62
A0
  Bottom 0.508: A6.2 A6.1 92.95,60.72 118.11,35.56 173.99,35.56 180.34,41.91 180.34,66.04 157.48,88.9 157.48,95.19 U$1.14_1
A1
  Bottom 0.508: A4.2 A4.1 93.38,36.16 97.79,31.75 173.99,31.75 178.44,36.2 | U$1.14_2 160.02,95.19 160.02,91.44 184.15,67.31 184.15,41.91 178.44,36.2 | 178.41,36.16 178.44,36.2
A3
  Bottom 0.508: A2.2 A2.1 93.6,12.32 109.22,27.94 173.99,27.94 187.96,41.91 187.96,69.85 165.1,92.71 165.1,95.19 U$1.14_4
AREF
  Bottom 0.508: R24.2 99.07,85.08 130.81,53.34 130.81,47.28 U$1.9_8
GND  (via drill 1.02 pad 1.78)
  Top 0.508: v68.58,66.8 v68.58,59.69 | v68.56,51.37 68.56,57.13 v68.58,57.15 | v68.58,41.4 v68.58,35.56 | v68.58,33.02 v68.58,26.74 | v68.58,17.27 v68.58,11.43 | v68.58,8.89 v68.58,3.3
  Bottom 0.508: v68.58,59.69 v68.58,57.15 | v68.58,35.56 v68.58,33.02 | v68.58,11.43 v68.58,8.89 | 149.86,119.38 149.86,95.29
  Bottom 1.27: 149.86,95.29 U$1.11_7
  Bottom 2: 34.29,59.69 35.56,58.42 38.65,58.42 T3.9
  Bottom 2.54: 149.86,119.38 123.19,146.05 22.19,146.05 21.26,145.12 21.26,137.23 22.23,136.26 | 22.23,136.26 24.74,133.75 27.31,133.75 31.89,138.33 31.89,138.91 J3.2 | 34.29,59.69 34.29,80.32 34.36,81.07 9.65,81.07 6.65,83.42 6.66,120.41 6.66,120.69 22.23,136.26
  pour Bottom (isolate 0.406): 1.27,148.59 1.27,78.74 96.52,78.74 96.52,148.59
  pour Bottom (isolate 0.406): 154.94,86.36 154.94,99.06 198.12,99.06 198.12,1.27 31.75,1.27 31.75,77.47 96.52,77.47 96.52,66.04 124.46,38.1 172.72,38.1 177.8,43.18 177.8,63.5
  pour Bottom (isolate 0.406): 97.79,148.59 97.79,66.67 125.09,39.37 172.09,39.37 176.53,43.81 176.53,62.87 153.67,85.72 153.67,100.33 198.12,100.33 198.12,148.59
N$1
  Bottom 0.5: 24.13,22.86 23.94,22.86 T1.1
  Bottom 0.508: R1.2 18.35,17.28 23.94,22.86
N$2
  Bottom 0.5: 49.53,5.08 55.32,5.08 58.16,7.92 58.16,9.42 58.45,9.71 60.32,9.71 A1.3
  Bottom 0.508: T1.7 43.87,19.93 R2.2 46.03,18.66 47.53,17.16 47.53,7.08 49.53,5.08
N$3
  Bottom 0.5: R3.1 51.28,16.99 49.53,15.24 49.53,10.16 50.8,8.89 52.72,8.89 53.51,9.68 55.37,9.68 A1.6
N$4
  Bottom 0.5: R3.2 59.77,23.95 C1.1 C2.1 | R4.1 76.82,23.98
  Bottom 0.508: C2.1 76.83,23.93 R4.1
N$5
  Bottom 0.5: R4.2 R9.1
N$6
  Bottom 0.508: A2.3 80.01,9.78 | 80.01,9.78 A2.6 | 80.01,11.01 80.01,9.78 | 80.01,11.01 80.01,13.97 76.44,13.97 C2.2 | A2.7 79.97,11.05 80.01,11.01
N$7
  Bottom 0.5: R7.1 R5.2
N$8
  Bottom 0.5: J1.2 12.39,11.74 10.16,13.97 10.16,17.14 R8.1
N$9
  Bottom 0.5: T1.5 23.68,6.74
  Bottom 0.508: J1.1 23.68,6.74 T1.5
N$10
  Bottom 0.5: R8.2 R1.1
N$11
  Bottom 0.5: 18.83,110.48 C7.+
  Bottom 1.016: D2.C 32.41,129.26 D1.C 19.32,115.7 C7.+ 19.32,109.5 18.85,109.03 18.87,109.01 C11.2 | 18.9,103.15 C11.2 | Q2.1 16.74,97.27 18.84,99.36 18.84,103.08 C11.2
N$12
  Bottom 1.016: D4.A 38.24,129.26 D3.A 37.23,111.68 C8.- | C8.- | C8.- 37.23,104.99 C12.2 37.11,101.11 37.11,95.4 37.92,94.59 Q1.2
N$13
  Bottom 1.016: D2.A D4.C 44.21,124.48 44.21,141.95 42.91,143.25 28.02,143.25 26.8,142.03 J3.1
N$14
  Bottom 0.5: D1.A 22.59,129.54
  Bottom 1.016: D1.A D3.C 30.77,130.84 30.77,130.88 36.8,136.91 J3.3
N$15  (via drill 1.02 pad 1.78)
  Top 0.508: v80.17,24 v80.17,6.9
  Bottom 0.5: v80.17,24 84.05,24 R9.2
  Bottom 0.508: v80.17,6.9 79.54,6.9 A2.5
N$16
  Bottom 0.5: R11.1 57.73,109.13 LED1.A
N$17
  Bottom 0.5: R10.1 57.73,89.63 LED2.K
N$18
  Bottom 0.5: 24.13,46.99 23.94,46.99 T2.1
  Bottom 0.508: R12.2 18.55,41.41 24.13,46.99
N$19
  Bottom 0.508: A3.3 60.37,33.6 58.49,33.6 58.42,33.54 58.42,31.75 54.56,27.89 49.66,27.89 47.37,30.18 47.37,41.55 46.03,42.89 R13.2 43.96,44.06 T2.7
N$20
  Bottom 0.5: R14.1 51.28,41.12 49.53,39.37 49.53,34.29 | A3.6
  Bottom 0.508: 49.53,34.29 49.53,34.15 50.03,33.65 55.43,33.65 A3.6
N$21
  Bottom 0.5: R14.2 59.77,49.08 C13.1 C14.1 76.82,49.11 R15.1
N$22
  Bottom 0.508: A4.6 80.01,33.62 | 80.01,33.62 A4.3 | 80.01,33.62 80.01,34.29 80.01,34.9 | 80.01,34.9 80.01,38.1 76.2,38.1 68.58,45.72 68.58,46.96 C14.2 | A4.7 80.01,34.9
N$23
  Bottom 0.5: T2.5 23.52,31.41
  Bottom 0.508: J4.1 23.52,31.41 T2.5
N$24
  Bottom 0.5: J4.2 11.85,36.41 10.16,38.1 10.16,41.27 R16.1
N$25
  Bottom 0.5: R16.2 R12.1
N$26
  Bottom 0.5: R15.2 R17.1
N$27  (via drill 1.02 pad 1.78)
  Top 0.508: v80.17,30.68 v80.17,49.2
  Bottom 0.5: v80.17,49.2 85.25,49.2 R17.2
  Bottom 0.508: v80.17,30.68 79.6,30.68 A4.5
N$28
  Bottom 0.5: 24.13,71.12 23.95,71.12 T3.1
  Bottom 0.508: R18.2 18.56,65.55 24.13,71.12
N$29
  Bottom 0.5: 49.79,52.93 54.87,52.93 58.42,57.15 58.42,58.16 58.43,58.17 A5.3
  Bottom 0.508: T3.7 44.06,68.2 R19.2 | R19.2 45.91,67.12 | R19.2 45.93,67.12 47.44,65.61 47.44,55.28 49.79,52.93
N$30
  Bottom 0.5: A5.6 55.44,58.16
  Bottom 0.508: A5.6 55.43,58.15 51.17,58.15 50.27,59.05 50.27,63.87 50.37,63.97 | 50.37,63.97 | 50.37,63.97 51.29,64.89 51.29,71.47 R20.1
N$31
  Bottom 0.5: R21.1 68.35,74.32 C20.1 C19.1 51.31,74.35 R20.2
N$32
  Bottom 0.508: A6.6 80.01,58.18 | 80.01,58.18 A6.3 | 80.01,59.45 80.01,58.18 | C20.2 68.58,72.19 68.58,69.85 76.2,62.23 80.01,62.23 80.01,59.69 80.01,59.45 | A6.7 80.01,59.45
N$33
  Bottom 0.5: T3.5 23.7,55.37
  Bottom 0.508: J5.1 23.7,55.37 T3.5
N$34
  Bottom 0.5: J5.2 12.02,60.37 10.16,62.23 10.16,65.41 R22.1
N$35
  Bottom 0.5: R22.2 R18.1
N$36
  Bottom 0.5: R21.2 R23.1
N$37  (via drill 1.02 pad 1.78)
  Top 0.508: v80.17,74.31 v80.17,54.91
  Bottom 0.5: v80.17,74.31 85.36,74.31 R23.2
  Bottom 0.508: v80.17,54.91 79.92,54.91 A6.5
N$38
  pour Bottom (isolate 2.032, rank 2): 30.48,77.47 1.27,77.47 1.27,76.2 1.27,1.27 30.48,1.27
N$39
  Bottom 0.508: IC3.5 85.39,85.09 R24.1
PPS
  Bottom 0.508: U$1.9_6 135.89,46.68 135.89,45.72 138.43,43.18 171.45,43.18 172.72,44.45 172.72,48.26 171.45,49.53 170.18,49.53 104.9,114.81 98.55,114.81 77.98,135.38 77.98,137.67 78.65,138.34 79.92,138.34 81.28,139.7 81.28,140.46 CN1.3
RX
  Bottom 0.508: U$1.13_1 170.18,47.03 170.18,48.26 104.52,113.92 98.17,113.92 77.09,135 77.09,138.05 78.74,139.7 78.74,140.46 CN1.2
TX
  Bottom 0.508: U$1.13_2 167.64,47.03 167.64,49.53 104.14,113.03 97.79,113.03 76.2,134.62 76.2,140.46 CN1.1
VBIAS  (via drill 1.02 pad 1.78)
  Top 0.5: v72.39,83.82 v72.39,90.17
  Top 0.508: v68.58,83.82 66.04,83.82 63.5,81.28 53.35,81.51 v53.35,55.36 v53.34,55.35 | v50.81,55.35 50.8,53.34 53.34,50.8 v53.34,30.89 | v50.8,30.89 50.8,29.21 53.34,26.67 v53.34,7.25
  Bottom 0.5: R5.1 R6.2 76.67,99.53 72.39,95.25 v72.39,90.17 | IC3.1 73.66,85.09 v72.39,83.82 | v53.34,7.25 54.57,7.25 A1.5 | 53.59,30.89 v53.34,30.89
  Bottom 0.508: 53.69,55.35 v53.34,55.35 | v72.39,83.82 v68.58,83.82 | v50.8,7.25 v53.34,7.25 | v50.8,30.89 v53.34,30.89 54,30.89 A3.5 | v50.81,55.35 v53.34,55.35 | v53.34,55.35 53.91,55.35 A5.5